# Altium schematic sheet MB963.SchDoc
size A4; DocumentNumber: 1; Revision: C.1(PCB.SCH); SheetNumber: 1; SheetTotal: 6; PageSetup: Record=PageOptions|CenterHorizontal=True|CenterVertical=True|PrintScale=1.00|XCorrection=1.00|YCorrection=1.00|PrintKind=1|BorderSize=5000000|LeftOffset=0|BottomOffset=0|Orientation=2|PaperLength=1000|PaperWidth=1000|Scale=100|PaperSource=15|PrintQuality=1200|MediaType=1|DitherType=10|PaperKind=A4|PrintScaleMode=1
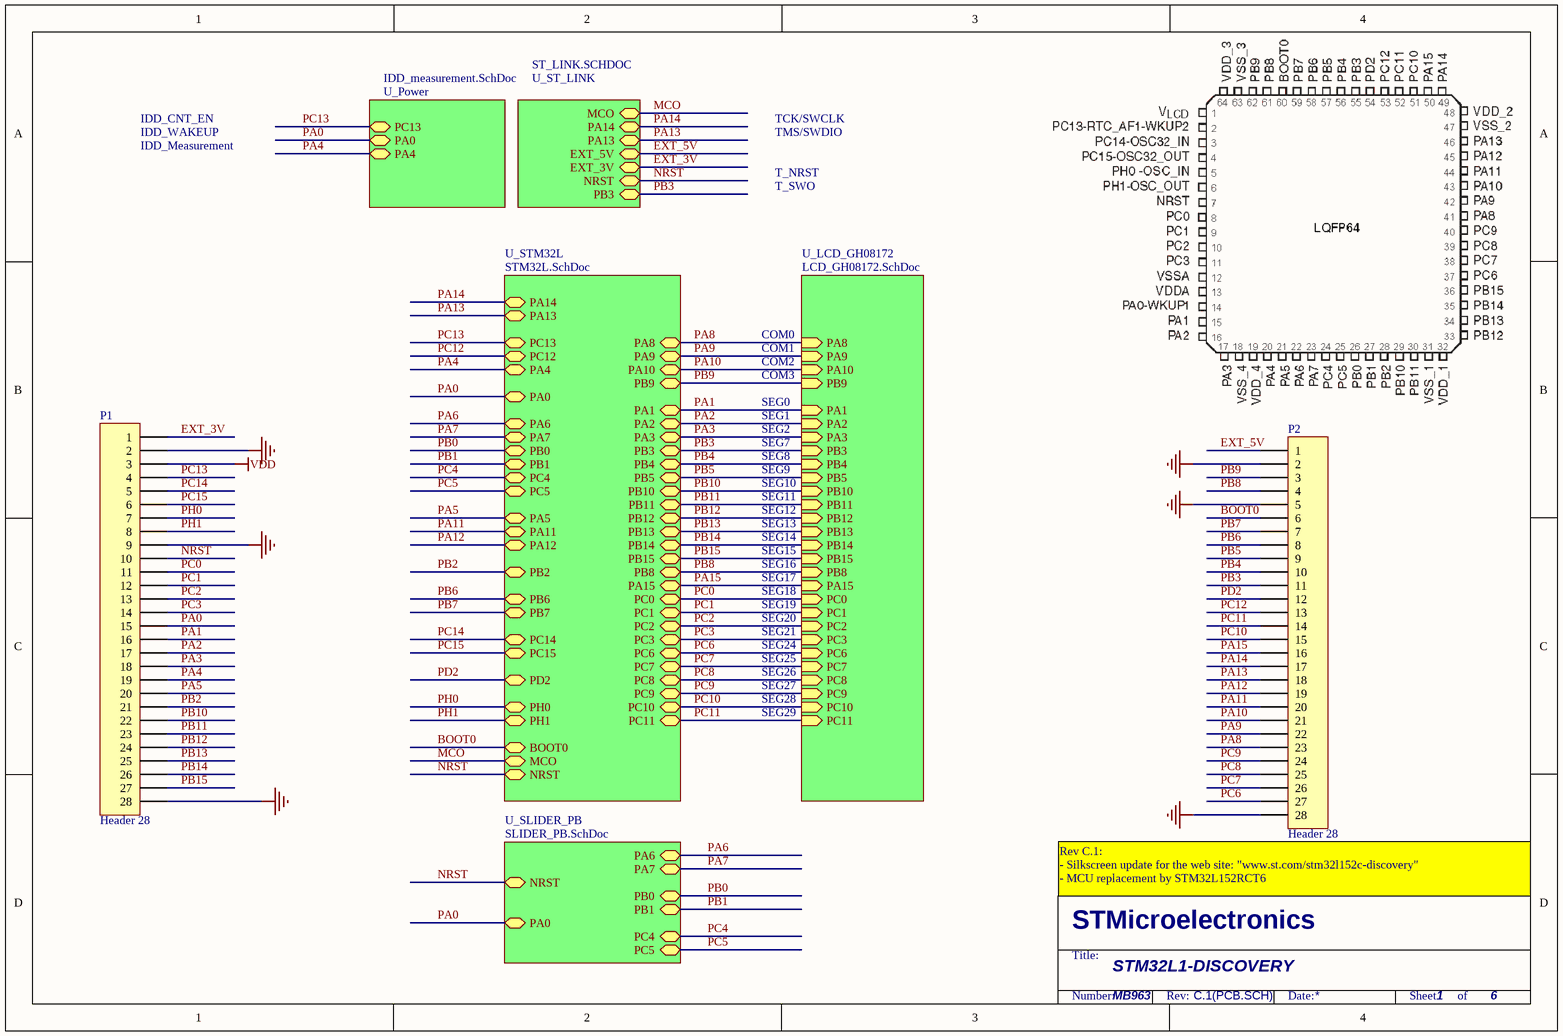
[diagram p0: MB963.SchDoc]

## Parts
P1  Header 28  [HDR1X28]
P2  Header 28  [HDR1X28]

## Sub-sheets
U_LCD_GH08172 = LCD_GH08172.SchDoc: PB8 (in), PA15 (in), PB15 (in), PC2 (in), PC1 (in), PC0 (in), PC11 (in), PC10 (in), PC9 (in), PC8 (in), PC3 (in), PC7 (in), PC6 (in), PA8 (in), PA9 (in), PA10 (in), PA1 (in), PA2 (in), PA3 (in), PB3 (in), PB4 (in), PB5 (in), PB10 (in), PB11 (in), PB9 (in), PB12 (in), PB13 (in), PB14 (in)
U_Power = IDD_measurement.SchDoc: PA4, PA0, PC13
U_SLIDER_PB = SLIDER_PB.SchDoc: NRST, PA0, PB0, PC4, PA6, PA7, PC5, PB1
U_ST_LINK = ST_LINK.SCHDOC: PA13, PA14, EXT_5V, EXT_3V, MCO, NRST, PB3
U_STM32L = STM32L.SchDoc: PA13, PA14, PA15 (bidir), PA12, PA0, PA1 (bidir), PA2 (bidir), PA3 (bidir), PA4, PA5, PA6, PA7, PA8 (bidir), PA9 (bidir), PA10 (bidir), PA11, PB12 (bidir), PB0, PB1, PB2, PB3 (bidir), PB4 (bidir), PB5 (bidir), PB6, PB7, PB8 (bidir), PB9 (bidir), PB10 (bidir), PB11 (bidir), PB13 (bidir), PB14 (bidir), PB15 (bidir), PC3 (bidir), PC15, PC14, PC13, PC12, PC11 (bidir), PC10 (bidir), PC9 (bidir), PC8 (bidir), PC7 (bidir), PC6 (bidir), PC5, PC4, PC2 (bidir), PC1 (bidir), PC0 (bidir), PD2, BOOT0, PH1, PH0, NRST, MCO

## Nets
GND: P1.2 P1.9 P1.28 P2.2 P2.5 P2.28
VDD: P1.3
BOOT0: P2.6 ; sheet U_STM32L/BOOT0
EXT_3V: P1.1 ; sheet U_ST_LINK/EXT_3V
EXT_5V: P2.1 ; sheet U_ST_LINK/EXT_5V
MCO: sheet U_ST_LINK/MCO, sheet U_STM32L/MCO
NRST: P1.10 ; sheet U_ST_LINK/NRST, sheet U_STM32L/NRST, sheet U_SLIDER_PB/NRST
PA0: P1.15 ; sheet U_Power/PA0, sheet U_STM32L/PA0, sheet U_SLIDER_PB/PA0
PA1: P1.16 ; sheet U_STM32L/PA1, sheet U_LCD_GH08172/PA1
PA2: P1.17 ; sheet U_STM32L/PA2, sheet U_LCD_GH08172/PA2
PA3: P1.18 ; sheet U_STM32L/PA3, sheet U_LCD_GH08172/PA3
PA4: P1.19 ; sheet U_Power/PA4, sheet U_STM32L/PA4
PA5: P1.20 ; sheet U_STM32L/PA5
PA6: sheet U_STM32L/PA6, sheet U_SLIDER_PB/PA6
PA7: sheet U_STM32L/PA7, sheet U_SLIDER_PB/PA7
PA8: P2.23 ; sheet U_STM32L/PA8, sheet U_LCD_GH08172/PA8
PA9: P2.22 ; sheet U_STM32L/PA9, sheet U_LCD_GH08172/PA9
PA10: P2.21 ; sheet U_STM32L/PA10, sheet U_LCD_GH08172/PA10
PA11: P2.20 ; sheet U_STM32L/PA11
PA12: P2.19 ; sheet U_STM32L/PA12
PA13: P2.18 ; sheet U_ST_LINK/PA13, sheet U_STM32L/PA13
PA14: P2.17 ; sheet U_ST_LINK/PA14, sheet U_STM32L/PA14
PA15: P2.16 ; sheet U_STM32L/PA15, sheet U_LCD_GH08172/PA15
PB0: sheet U_STM32L/PB0, sheet U_SLIDER_PB/PB0
PB1: sheet U_STM32L/PB1, sheet U_SLIDER_PB/PB1
PB2: P1.21 ; sheet U_STM32L/PB2
PB3: P2.11 ; sheet U_ST_LINK/PB3, sheet U_STM32L/PB3, sheet U_LCD_GH08172/PB3
PB4: P2.10 ; sheet U_STM32L/PB4, sheet U_LCD_GH08172/PB4
PB5: P2.9 ; sheet U_STM32L/PB5, sheet U_LCD_GH08172/PB5
PB6: P2.8 ; sheet U_STM32L/PB6
PB7: P2.7 ; sheet U_STM32L/PB7
PB8: P2.4 ; sheet U_STM32L/PB8, sheet U_LCD_GH08172/PB8
PB9: P2.3 ; sheet U_STM32L/PB9, sheet U_LCD_GH08172/PB9
PB10: P1.22 ; sheet U_STM32L/PB10, sheet U_LCD_GH08172/PB10
PB11: P1.23 ; sheet U_STM32L/PB11, sheet U_LCD_GH08172/PB11
PB12: P1.24 ; sheet U_STM32L/PB12, sheet U_LCD_GH08172/PB12
PB13: P1.25 ; sheet U_STM32L/PB13, sheet U_LCD_GH08172/PB13
PB14: P1.26 ; sheet U_STM32L/PB14, sheet U_LCD_GH08172/PB14
PB15: P1.27 ; sheet U_STM32L/PB15, sheet U_LCD_GH08172/PB15
PC0: P1.11 ; sheet U_STM32L/PC0, sheet U_LCD_GH08172/PC0
PC1: P1.12 ; sheet U_STM32L/PC1, sheet U_LCD_GH08172/PC1
PC2: P1.13 ; sheet U_STM32L/PC2, sheet U_LCD_GH08172/PC2
PC3: P1.14 ; sheet U_STM32L/PC3, sheet U_LCD_GH08172/PC3
PC4: sheet U_STM32L/PC4, sheet U_SLIDER_PB/PC4
PC5: sheet U_STM32L/PC5, sheet U_SLIDER_PB/PC5
PC6: P2.27 ; sheet U_STM32L/PC6, sheet U_LCD_GH08172/PC6
PC7: P2.26 ; sheet U_STM32L/PC7, sheet U_LCD_GH08172/PC7
PC8: P2.25 ; sheet U_STM32L/PC8, sheet U_LCD_GH08172/PC8
PC9: P2.24 ; sheet U_STM32L/PC9, sheet U_LCD_GH08172/PC9
PC10: P2.15 ; sheet U_STM32L/PC10, sheet U_LCD_GH08172/PC10
PC11: P2.14 ; sheet U_STM32L/PC11, sheet U_LCD_GH08172/PC11
PC12: P2.13 ; sheet U_STM32L/PC12
PC13: P1.4 ; sheet U_Power/PC13, sheet U_STM32L/PC13
PC14: P1.5 ; sheet U_STM32L/PC14
PC15: P1.6 ; sheet U_STM32L/PC15
PD2: P2.12 ; sheet U_STM32L/PD2
PH0: P1.7 ; sheet U_STM32L/PH0
PH1: P1.8 ; sheet U_STM32L/PH1

## Notes on the sheet
- IDD_WAKEUP
- IDD_CNT_EN
- IDD_Measurement
- TCK/SWCLK
- TMS/SWDIO
- T_NRST
- T_SWO
- COM0
- COM1
- COM2
- COM3
- SEG0
- SEG1
- SEG2
- SEG7
- SEG8
- SEG9
- SEG10
- SEG11
- SEG12
- SEG13
- SEG14
- SEG15
- SEG16
- SEG17
- SEG18
- SEG19
- SEG20
- SEG21
- SEG24
- SEG25
- SEG26
- SEG27
- SEG28
- SEG29
- (near P2) Rev C.1:
  - Silkscreen update for the web site: "www.st.com/stm32l152c-discovery"
  - MCU replacement by STM32L152RCT6
- STM32L1-DISCOVERY
- MB963
- 1
- STMicroelectronics
- Title:
- Number:
- Rev:
- Date:
- Sheet       of

## Library data of the parts
P1 P2 = Header 28: Header, 28-Pin; LatestRevisionDate: 17-Jul-2002; LatestRevisionNote: Re-released for DXP Platform.; Publisher: Altium Limited